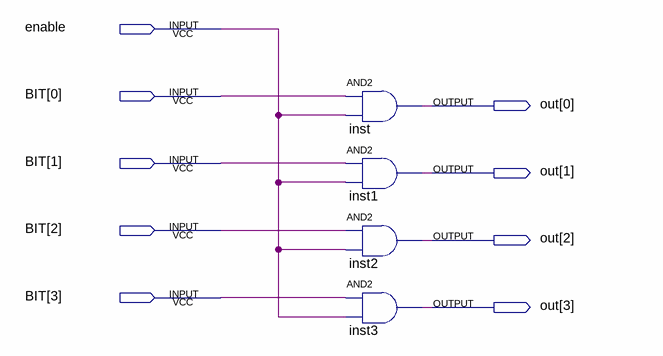
[diagram p0: schematic sheet]
// Quartus schematic chave_4bits.bdf as structural Verilog: 4 symbols, 9 pins
module chave_4bits (
  input  enable,
  input  [3:0] BIT,
  output [3:0] out
);

  and inst (out[0], BIT[0], enable);
  and inst1 (out[1], BIT[1], enable);
  and inst2 (out[2], BIT[2], enable);
  and inst3 (out[3], BIT[3], enable);
endmodule
